# Altium project 2018_CARTE_SENSORS5.PRJPCB
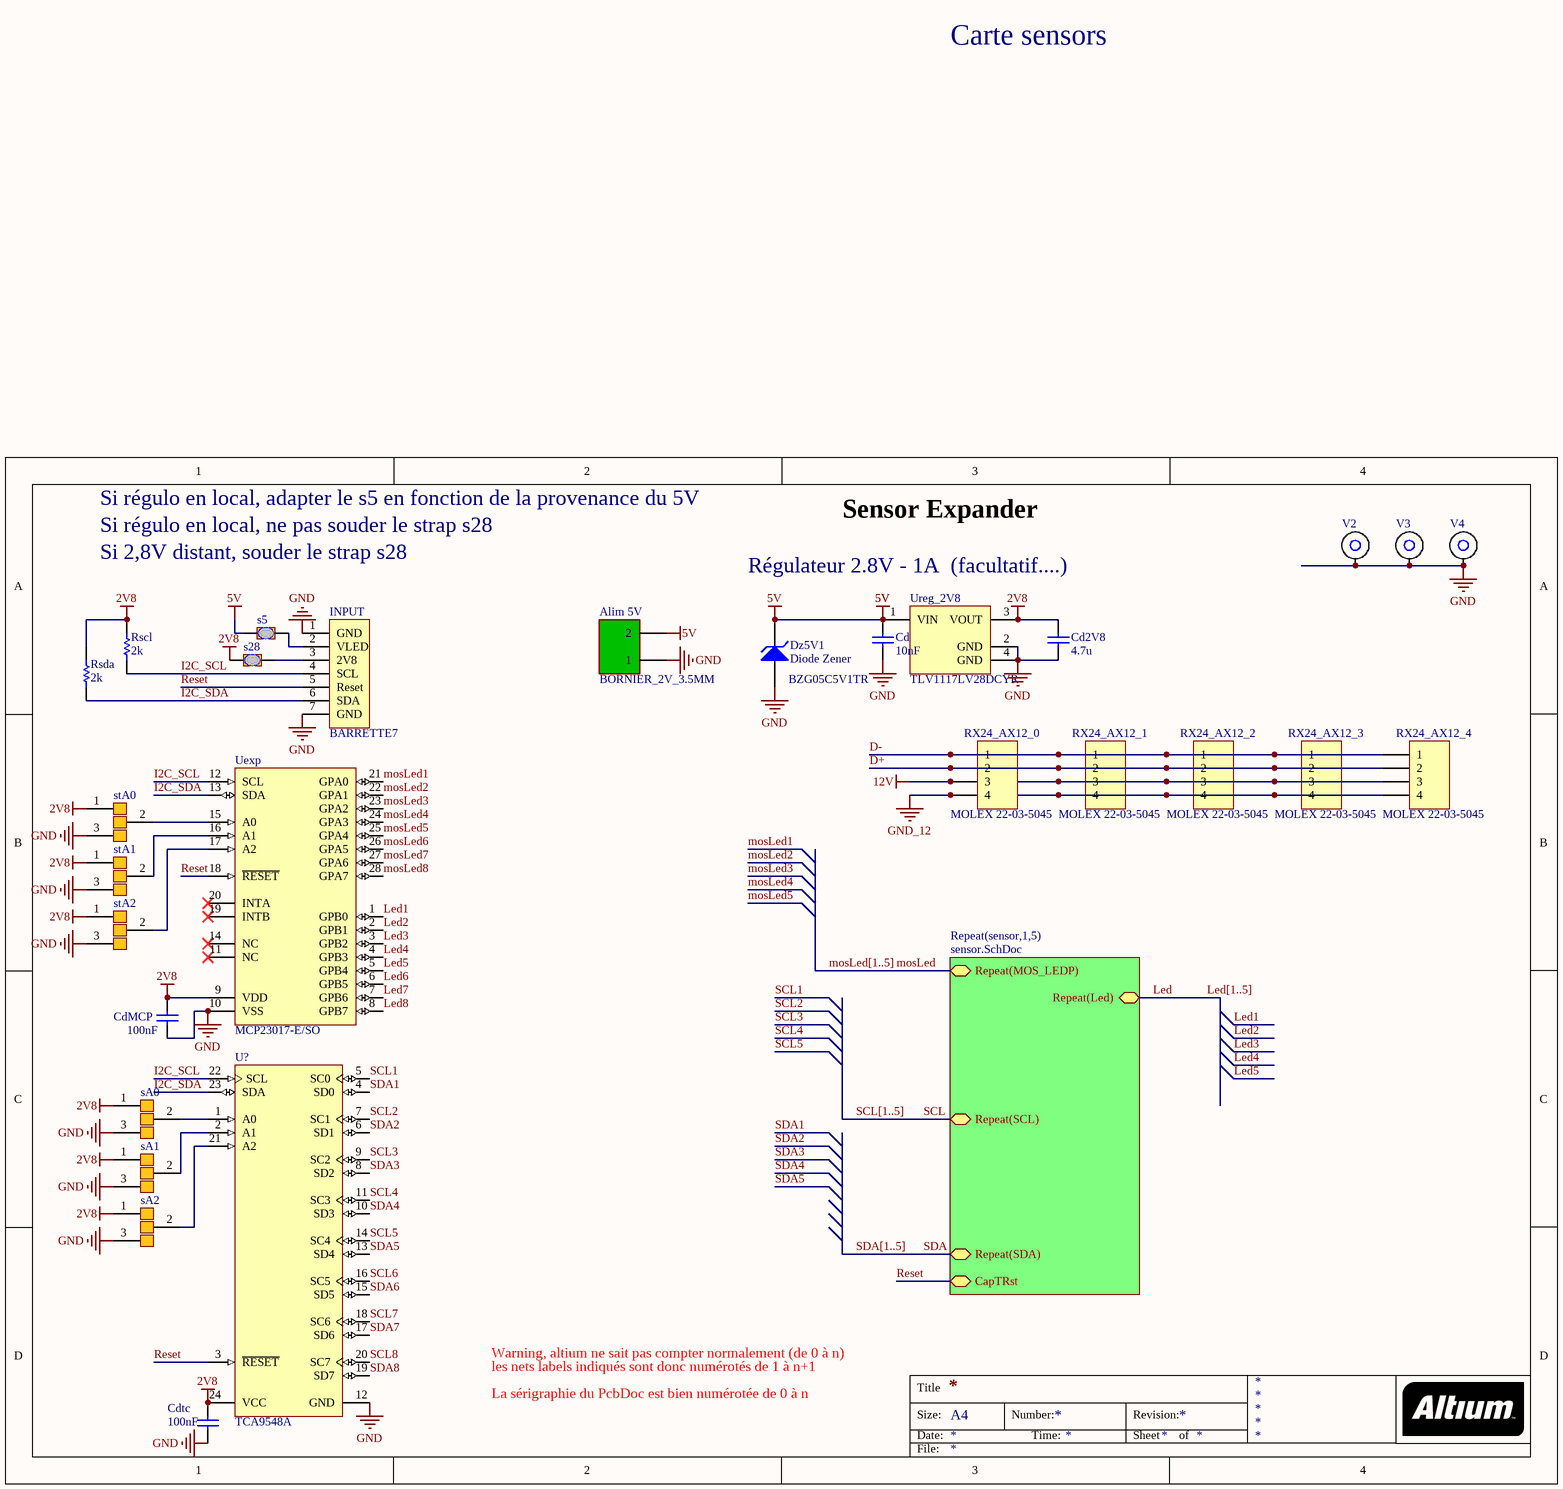
[diagram p0: 2018_CARTE_SENSORS5.SchDoc]
2 sheets, 63 parts. Net scope: hierarchical (ports join the sheet entries above them; power ports are global).
Board file: 2018_CARTE_SENSORS5.PCBDOC
Sheets:
  2018_CARTE_SENSORS5.SchDoc
    sensor1 = sensor.SchDoc
    sensor2 = sensor.SchDoc
    sensor3 = sensor.SchDoc
    sensor4 = sensor.SchDoc
    sensor5 = sensor.SchDoc

## Sheet 2018_CARTE_SENSORS5.SchDoc
size A4

### Parts
Alim_5V  BORNIER_2V_3.5MM  [BORNIER_2V_3.5MM]
Cd  10nF  [C0805_N]
Cd2V8  4.7u  [C1206_N]
CdMCP  100nF  [C0805_N]
Cdtc  100nF  [C0805_N]
Dz5V1  Diode Zener  [SMA Diode]
INPUT  BARRETTE7  [MOLEX7_2.50MM]
Rscl  2k  [R1206_N]
Rsda  2k  [R1206_N]
RX24_AX12_0  MOLEX 22-03-5045  [MOLEX4_2.5MM]
RX24_AX12_1  MOLEX 22-03-5045  [MOLEX4_2.5MM]
RX24_AX12_2  MOLEX 22-03-5045  [MOLEX4_2.5MM]
RX24_AX12_3  MOLEX 22-03-5045  [MOLEX4_2.5MM]
RX24_AX12_4  MOLEX 22-03-5045  [MOLEX4_2.5MM]
s5  Goutte Strap_2  [Goutte Strap_2 Pads_Clearance 0.254mm]  (value not drawn)
s28  Goutte Strap_2  [Goutte Strap_2 Pads_Clearance 0.254mm]  (value not drawn)
sA0  Goutte Strap_3  [Goutte Strap_3 PADS]  (value not drawn)
sA1  Goutte Strap_3  [Goutte Strap_3 PADS]  (value not drawn)
sA2  Goutte Strap_3  [Goutte Strap_3 PADS]  (value not drawn)
stA0  Goutte Strap_3  [Goutte Strap_3 PADS]  (value not drawn)
stA1  Goutte Strap_3  [Goutte Strap_3 PADS]  (value not drawn)
stA2  Goutte Strap_3  [Goutte Strap_3 PADS]  (value not drawn)
U?  TCA9548A  [DB24_N]
Uexp  MCP23017-E/SO  [SOIC-SO28_N]
Ureg_2V8  TLV1117LV28DCYR  [SOT223-4N]
V2  Entretoise WURTH CMS  [ENTRETOISE_CMS]  (value not drawn)
V3  Entretoise WURTH CMS  [ENTRETOISE_CMS]  (value not drawn)
V4  Entretoise WURTH CMS  [ENTRETOISE_CMS]  (value not drawn)

### Sub-sheets
Repeat(sensor,1,5) = sensor.SchDoc: Repeat(MOS_LEDP), CapTRst, Repeat(Led), Repeat(SCL), Repeat(SDA)

### Nets
2V8: Cd2V8.2 CdMCP.2 Cdtc.2 Rscl.1 Rsda.1 s28.1 sA0.1 sA1.1 sA2.1 stA0.1 stA1.1 stA2.1 U?.24(VCC) Uexp.9(VDD) Ureg_2V8.3(VOUT)
5V: Alim_5V.2 Cd.2 Dz5V1.2(K) s5.1 Ureg_2V8.1(VIN)
12V: RX24_AX12_0.3 RX24_AX12_1.3 RX24_AX12_2.3 RX24_AX12_3.3 RX24_AX12_4.3
GND: Alim_5V.1 Cd.1 Cd2V8.1 CdMCP.1 Cdtc.1 Dz5V1.1(A) INPUT.1(GND) INPUT.7(GND) sA0.3 sA1.3 sA2.3 stA0.3 stA1.3 stA2.3 U?.12(GND) Uexp.10(VSS) Ureg_2V8.2(GND) Ureg_2V8.4(GND) V2.1 V3.1 V4.1
GND_12: RX24_AX12_0.4 RX24_AX12_1.4 RX24_AX12_2.4 RX24_AX12_3.4 RX24_AX12_4.4
D+: RX24_AX12_0.2 RX24_AX12_1.2 RX24_AX12_2.2 RX24_AX12_3.2 RX24_AX12_4.2
D-: RX24_AX12_0.1 RX24_AX12_1.1 RX24_AX12_2.1 RX24_AX12_3.1 RX24_AX12_4.1
I2C_SCL: INPUT.4(SCL) Rscl.2 U?.22(SCL) Uexp.12(SCL)
I2C_SDA: INPUT.6(SDA) Rsda.2 U?.23(SDA) Uexp.13(SDA)
Led: sheet Repeat(sensor,1,5)/Repeat(Led)
Led1: Uexp.1(GPB0)
Led2: Uexp.2(GPB1)
Led3: Uexp.3(GPB2)
Led4: Uexp.4(GPB3)
Led5: Uexp.5(GPB4)
Led6: Uexp.6(GPB5)
Led7: Uexp.7(GPB6)
Led8: Uexp.8(GPB7)
mosLed: sheet Repeat(sensor,1,5)/Repeat(MOS_LEDP)
mosLed1: Uexp.21(GPA0)
mosLed2: Uexp.22(GPA1)
mosLed3: Uexp.23(GPA2)
mosLed4: Uexp.24(GPA3)
mosLed5: Uexp.25(GPA4)
mosLed6: Uexp.26(GPA5)
mosLed7: Uexp.27(GPA6)
mosLed8: Uexp.28(GPA7)
Reset: INPUT.5(Reset) U?.3(~{RESET}) Uexp.18(~{RESET}) ; sheet Repeat(sensor,1,5)/CapTRst  [project net CAPTRst]
SCL: sheet Repeat(sensor,1,5)/Repeat(SCL)
SCL1: U?.5(SC0)
SCL2: U?.7(SC1)
SCL3: U?.9(SC2)
SCL4: U?.11(SC3)
SCL5: U?.14(SC4)
SCL6: U?.16(SC5)
SCL7: U?.18(SC6)
SCL8: U?.20(SC7)
SDA: sheet Repeat(sensor,1,5)/Repeat(SDA)
SDA1: U?.4(SD0)
SDA2: U?.6(SD1)
SDA3: U?.8(SD2)
SDA4: U?.10(SD3)
SDA5: U?.13(SD4)
SDA6: U?.15(SD5)
SDA7: U?.17(SD6)
SDA8: U?.19(SD7)
NetINPUT_2: INPUT.2(VLED) s5.2
NetINPUT_3: INPUT.3(2V8) s28.2
NetsA0_2: sA0.2 U?.1(A0)
NetsA1_2: sA1.2 U?.2(A1)
NetsA2_2: sA2.2 U?.21(A2)
NetstA0_2: stA0.2 Uexp.15(A0)
NetstA1_2: stA1.2 Uexp.16(A1)
NetstA2_2: stA2.2 Uexp.17(A2)

Not connected (* = marked no-connect by the designer): Uexp 11(NC)* 14(NC)* 19(INTB)* 20(INTA)*

### Buses and harness runs
bus Led[1..5]
bus mosLed[1..5]
bus SCL[1..5]
bus SDA[1..5]

### Notes on the sheet
- Carte sensors
- Si régulo en local, ne pas souder le strap s28
- Si 2,8V distant, souder le strap s28
- Si régulo en local, adapter le s5 en fonction de la provenance du 5V
- Sensor Expander
- Régulateur 2.8V - 1A  (facultatif....)
- Warning, altium ne sait pas compter normalement (de 0 à n)
- les nets labels indiqués sont donc numérotés de 1 à n+1
- La sérigraphie du PcbDoc est bien numérotée de 0 à n
- Title
- Size:
- Date:
- A4
- Number:
- Time:
- Revision:
- Sheet
- of
- File:
- (in symbol Diode Zener) BZG05C5V1TR

### Library data of the parts
Cd CdMCP Cdtc = Condensateur: Capacitor; Published: 8-Jun-2000; LatestRevisionDate: 17-Jul-2002; LatestRevisionNote: Re-released for DXP Platform.; PackageReference: RAD-0.3; Publisher: Altium Limited
Cd2V8 = Capacitor: Published: 8-Jun-2000; LatestRevisionDate: 17-Jul-2002; LatestRevisionNote: Re-released for DXP Platform.; PackageReference: RAD-0.3; Publisher: Altium Limited
Dz5V1 = Diode Zener: Zener Diode
INPUT = BARRETTE7: Header, 6-Pin; LatestRevisionDate: 17-Jul-2002; LatestRevisionNote: Re-released for DXP Platform.; Publisher: Altium Limited
Rscl Rsda = Resistor: Published: 8-Jun-2000; LatestRevisionDate: 17-Jul-2002; LatestRevisionNote: Re-released for DXP Platform.; PackageReference: AXIAL-0.5; Publisher: Altium Limited
RX24_AX12_0-RX24_AX12_4 = BARRETTE4: Header, 4-Pin; LatestRevisionDate: 17-Jul-2002; LatestRevisionNote: Re-released for DXP Platform.; Publisher: Altium Limited
U? = PCA9548ADB: 8-Channel I2C Switch with Reset, 2.3 to 5.5 V, -40 to 85 degC, 24-pin SSOP (DB), Green (RoHS & no Sb/Br); Manufacturer: Texas Instruments; SubFamily: I2C Multiplexer, Switch; Technology Family: PCA; fSCLK(Max)(MHz): 100, 400; VCC(Min)(V): 2.3; VCC(Max)(V): 5.5; Max Frequency(kHz): 400; I2C Address: 1110 xxx; Channel Width: 8; Reset Input: Yes; Simultaneously Active Channels: 1 to 8; DatasheetVersion: SCPS143C; PackageVersion: revE, Dec-2001; PackageReference: DB24; PackageDescription: 24-Pin Plastic Small Outline Package, 8.2 x 5.3 mm Body, 0.65 mm Pitch; Supplier 1: Digi-Key; Supplier Part Number 1: PCA9548ADB-ND; Supplier 2: Farnell; Supplier Part Number 2: 1574999; Supplier 3: Newark; Supplier Part Number 3: 22M1598; Supplier 4: Mouser; Supplier Part Number 4: 595-PCA9548ADB; Eco-Plan: Green (RoHS & no Sb/Br); Vcc range(V): 2.3 to 5.5; 5V Tolerant I/O: Yes; Open Drain I/O Type: Yes; Mounting Technology: Surface Mount; PartNumber: PCA9548ADB; Code_JEDEC: MO-150; ComponentLink1Description: Datasheet; ComponentLink1URL: http://www.ti.com/general/docs/lit/getliterature.tsp?genericPartNumber=PCA9548A&fileType=pdf; ComponentLink2Description: Package Specification; ComponentLink2URL: http://www.ti.com/litv/pdf/mpds211a
Uexp = MCP23017-E/SO: 16-Bit I/O Expander with Serial Interface, 28-Pin SOIC, Extended Temperature; Manufacturer: Microchip; DatasheetVersion: revB, Feb-2007; PackageVersion: revBB, Aug-2009; PackageReference: SOIC-SO28; PackageDescription: 28-Lead Plastic Small Outline (SO) - Wide 7.50mm Body [SOIC]; Supplier 1: Digi-Key; Supplier Part Number 1: MCP23017-E/SO-ND; Supplier 2: Farnell; Supplier Part Number 2: 1332087; Supplier 3: Newark; Supplier Part Number 3: 31K2958; Supplier 4: Newark; Supplier Part Number 4: 34M7442; Supplier 5: Mouser; Supplier Part Number 5: 579-MCP23017-E/SO; Mounting Technology: Surface Mount; Code_JEDEC: MS-013; PartNumber: MCP23017-E/SO; ComponentLink1Description: Manufacturer URL; ComponentLink1URL: http://www.microchip.com/; ComponentLink2Description: Datasheet; ComponentLink2URL: http://ww1.microchip.com/downloads/en/DeviceDoc/21952b.pdf; ComponentLink3Description: Package Specification; ComponentLink3URL: http://www.microchip.com/stellent/groups/techpub_sg/documents/packagingspec/en012702.pdf
Ureg_2V8 = MCP1826S-3302E/DB: 1000 mA, Low Voltage, Low Quiescent Current LDO Regulator, 3-Pin SOT-223, Extended Temperature; FirstPublished: 29-Jan-2009; DatasheetVersion: revA, Aug-2007; PackageVersion: revBB, Aug-2009; PackageReference: SOT-223-DB3; Publisher: Altium Limited; PackageDescription: 3-Lead Plastic Small Outline Transistor (DB) [SOT-223]; Supplier 1: Digi-Key; Supplier Part Number 1: MCP1826S-3302E/DB-ND; Supplier 2: Farnell; Supplier Part Number 2: 1578424; Supplier 3: Newark; Supplier Part Number 3: 27M0037; ComponentLink1Description: Datasheet; ComponentLink1URL: http://ww1.microchip.com/downloads/en/DeviceDoc/22057a.pdf; ComponentLink2Description: Packaging Specification; ComponentLink2URL: http://www.microchip.com/stellent/groups/techpub_sg/documents/packagingspec/en012702.pdf; ComponentLink3Description: Microchip.com Home; ComponentLink3URL: http://www.microchip.com/
V2-V4 = Entretoise WURTH CMS: Entretoise Wurth; Publisher: Damien Guitton
s5 s28 = Goutte Strap_2: LatestRevisionDate: 30/01/11; Publisher: Damien Guitton
sA0-sA2 stA0-stA2 = Goutte Strap_3: LatestRevisionDate: 25/11/09; Publisher: Damien Guitton

## Sheet sensor.SchDoc
size A4
Used 5 times, as channels sensor1, sensor2, sensor3, sensor4, sensor5. Parts and nets are listed once, with the designators drawn on the sheet.
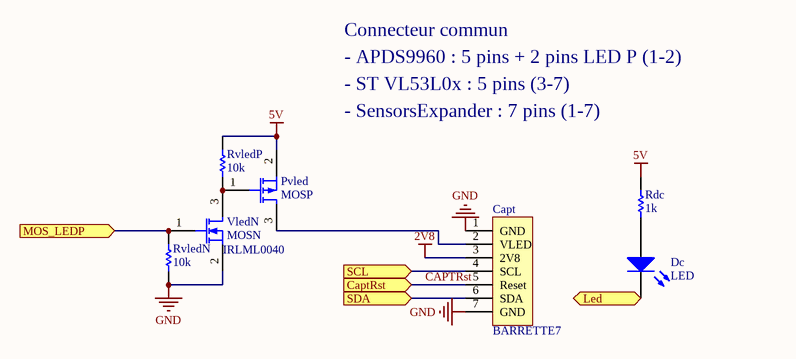
[diagram p1: sensor.SchDoc]

### Parts
Capt  BARRETTE7  [MOLEX7_2.50MM]
Dc  LED  [LED_0805]
Pvled  MOSP  [SOT23-3N]
Rdc  1k  [R1206_N]
RvledN  10k  [R1206_N]
RvledP  10k  [R1206_N]
VledN  MOSN  [SOT23-3N]

### Ports
CaptRst (in), Led (in), MOS_LEDP (in), SCL (in), SDA (in)

### Nets
2V8: Capt.3(2V8)
5V: Pvled.2(S) Rdc.1 RvledP.1
GND: Capt.1(GND) Capt.7(GND) RvledN.2 VledN.2(S)
CAPTRst: Capt.5(Reset) ; port CaptRst
Led: Dc.2(K) ; port Led
MOS_LEDP: RvledN.1 VledN.1(G) ; port MOS_LEDP
SCL: Capt.4(SCL) ; port SCL
SDA: Capt.6(SDA) ; port SDA
NetCapt_2: Capt.2(VLED) Pvled.3(D)
NetDc_1: Dc.1(A) Rdc.2
NetPvled_1: Pvled.1(G) RvledP.2 VledN.3(D)

### Channels
sensor1: designators end in _sensor1; ports CaptRst=CAPTRst Led=Led1 MOS_LEDP=mosLed1 SCL=SCL1 SDA=SDA1
sensor2: designators end in _sensor2; ports CaptRst=CAPTRst Led=Led2 MOS_LEDP=mosLed2 SCL=SCL2 SDA=SDA2
sensor3: designators end in _sensor3; ports CaptRst=CAPTRst Led=Led3 MOS_LEDP=mosLed3 SCL=SCL3 SDA=SDA3
sensor4: designators end in _sensor4; ports CaptRst=CAPTRst Led=Led4 MOS_LEDP=mosLed4 SCL=SCL4 SDA=SDA4
sensor5: designators end in _sensor5; ports CaptRst=CAPTRst Led=Led5 MOS_LEDP=mosLed5 SCL=SCL5 SDA=SDA5

### Notes on the sheet
- Connecteur commun
- - APDS9960 : 5 pins + 2 pins LED P (1-2)
- - ST VL53L0x : 5 pins (3-7)
- - SensorsExpander : 7 pins (1-7)
- (in symbol Transistor MOSFET-N) IRLML0040

### Library data of the parts
Capt = BARRETTE7: Header, 6-Pin; LatestRevisionDate: 17-Jul-2002; LatestRevisionNote: Re-released for DXP Platform.; Publisher: Altium Limited
Dc = LED: Typical LED; Published: 8-Jun-2000; LatestRevisionDate: 08-Jul-2005; LatestRevisionNote: Mech Layer 1 removed.; PackageReference: LED-1; Publisher: Altium Limited
Pvled = Transistor MOSFET-P: P-Channel MOSFET; PackageDocument: 1995/1996; Published: 8-Jun-2000; LatestRevisionDate: 17-Jul-2002; LatestRevisionNote: Re-released for DXP Platform.; PackageReference: E3; Publisher: Altium Limited
Rdc RvledN RvledP = Resistor: Published: 8-Jun-2000; LatestRevisionDate: 17-Jul-2002; LatestRevisionNote: Re-released for DXP Platform.; PackageReference: AXIAL-0.5; Publisher: Altium Limited
VledN = Transistor MOSFET-N: N-Channel MOSFET; PackageDocument: 1995/1996; Published: 8-Jun-2000; LatestRevisionDate: 17-Jul-2002; LatestRevisionNote: Re-released for DXP Platform.; PackageReference: E3; Publisher: Altium Limited

## Nets that join several sheets
2V8: 2018_CARTE_SENSORS5 (15 pins), sensor1 (Capt_sensor1.3), sensor2 (Capt_sensor2.3), sensor3 (Capt_sensor3.3), sensor4 (Capt_sensor4.3), sensor5 (Capt_sensor5.3)
5V: 2018_CARTE_SENSORS5 (5 pins), sensor1 (Pvled_sensor1.2 Rdc_sensor1.1 RvledP_sensor1.1), sensor2 (Pvled_sensor2.2 Rdc_sensor2.1 RvledP_sensor2.1), sensor3 (Pvled_sensor3.2 Rdc_sensor3.1 RvledP_sensor3.1), sensor4 (Pvled_sensor4.2 Rdc_sensor4.1 RvledP_sensor4.1), sensor5 (Pvled_sensor5.2 Rdc_sensor5.1 RvledP_sensor5.1)
GND: 2018_CARTE_SENSORS5 (21 pins), sensor1 (Capt_sensor1.1 Capt_sensor1.7 RvledN_sensor1.2 VledN_sensor1.2), sensor2 (Capt_sensor2.1 Capt_sensor2.7 RvledN_sensor2.2 VledN_sensor2.2), sensor3 (Capt_sensor3.1 Capt_sensor3.7 RvledN_sensor3.2 VledN_sensor3.2), sensor4 (Capt_sensor4.1 Capt_sensor4.7 RvledN_sensor4.2 VledN_sensor4.2), sensor5 (Capt_sensor5.1 Capt_sensor5.7 RvledN_sensor5.2 VledN_sensor5.2)
CAPTRst: 2018_CARTE_SENSORS5 (INPUT.5 U?.3 Uexp.18), sensor1 (Capt_sensor1.5), sensor2 (Capt_sensor2.5), sensor3 (Capt_sensor3.5), sensor4 (Capt_sensor4.5), sensor5 (Capt_sensor5.5)
Led1: 2018_CARTE_SENSORS5 (Uexp.1), sensor1 (Dc_sensor1.2)
Led2: 2018_CARTE_SENSORS5 (Uexp.2), sensor2 (Dc_sensor2.2)
Led3: 2018_CARTE_SENSORS5 (Uexp.3), sensor3 (Dc_sensor3.2)
Led4: 2018_CARTE_SENSORS5 (Uexp.4), sensor4 (Dc_sensor4.2)
Led5: 2018_CARTE_SENSORS5 (Uexp.5), sensor5 (Dc_sensor5.2)
mosLed1: 2018_CARTE_SENSORS5 (Uexp.21), sensor1 (RvledN_sensor1.1 VledN_sensor1.1)
mosLed2: 2018_CARTE_SENSORS5 (Uexp.22), sensor2 (RvledN_sensor2.1 VledN_sensor2.1)
mosLed3: 2018_CARTE_SENSORS5 (Uexp.23), sensor3 (RvledN_sensor3.1 VledN_sensor3.1)
mosLed4: 2018_CARTE_SENSORS5 (Uexp.24), sensor4 (RvledN_sensor4.1 VledN_sensor4.1)
mosLed5: 2018_CARTE_SENSORS5 (Uexp.25), sensor5 (RvledN_sensor5.1 VledN_sensor5.1)
SCL1: 2018_CARTE_SENSORS5 (U?.5), sensor1 (Capt_sensor1.4)
SCL2: 2018_CARTE_SENSORS5 (U?.7), sensor2 (Capt_sensor2.4)
SCL3: 2018_CARTE_SENSORS5 (U?.9), sensor3 (Capt_sensor3.4)
SCL4: 2018_CARTE_SENSORS5 (U?.11), sensor4 (Capt_sensor4.4)
SCL5: 2018_CARTE_SENSORS5 (U?.14), sensor5 (Capt_sensor5.4)
SDA1: 2018_CARTE_SENSORS5 (U?.4), sensor1 (Capt_sensor1.6)
SDA2: 2018_CARTE_SENSORS5 (U?.6), sensor2 (Capt_sensor2.6)
SDA3: 2018_CARTE_SENSORS5 (U?.8), sensor3 (Capt_sensor3.6)
SDA4: 2018_CARTE_SENSORS5 (U?.10), sensor4 (Capt_sensor4.6)
SDA5: 2018_CARTE_SENSORS5 (U?.13), sensor5 (Capt_sensor5.6)